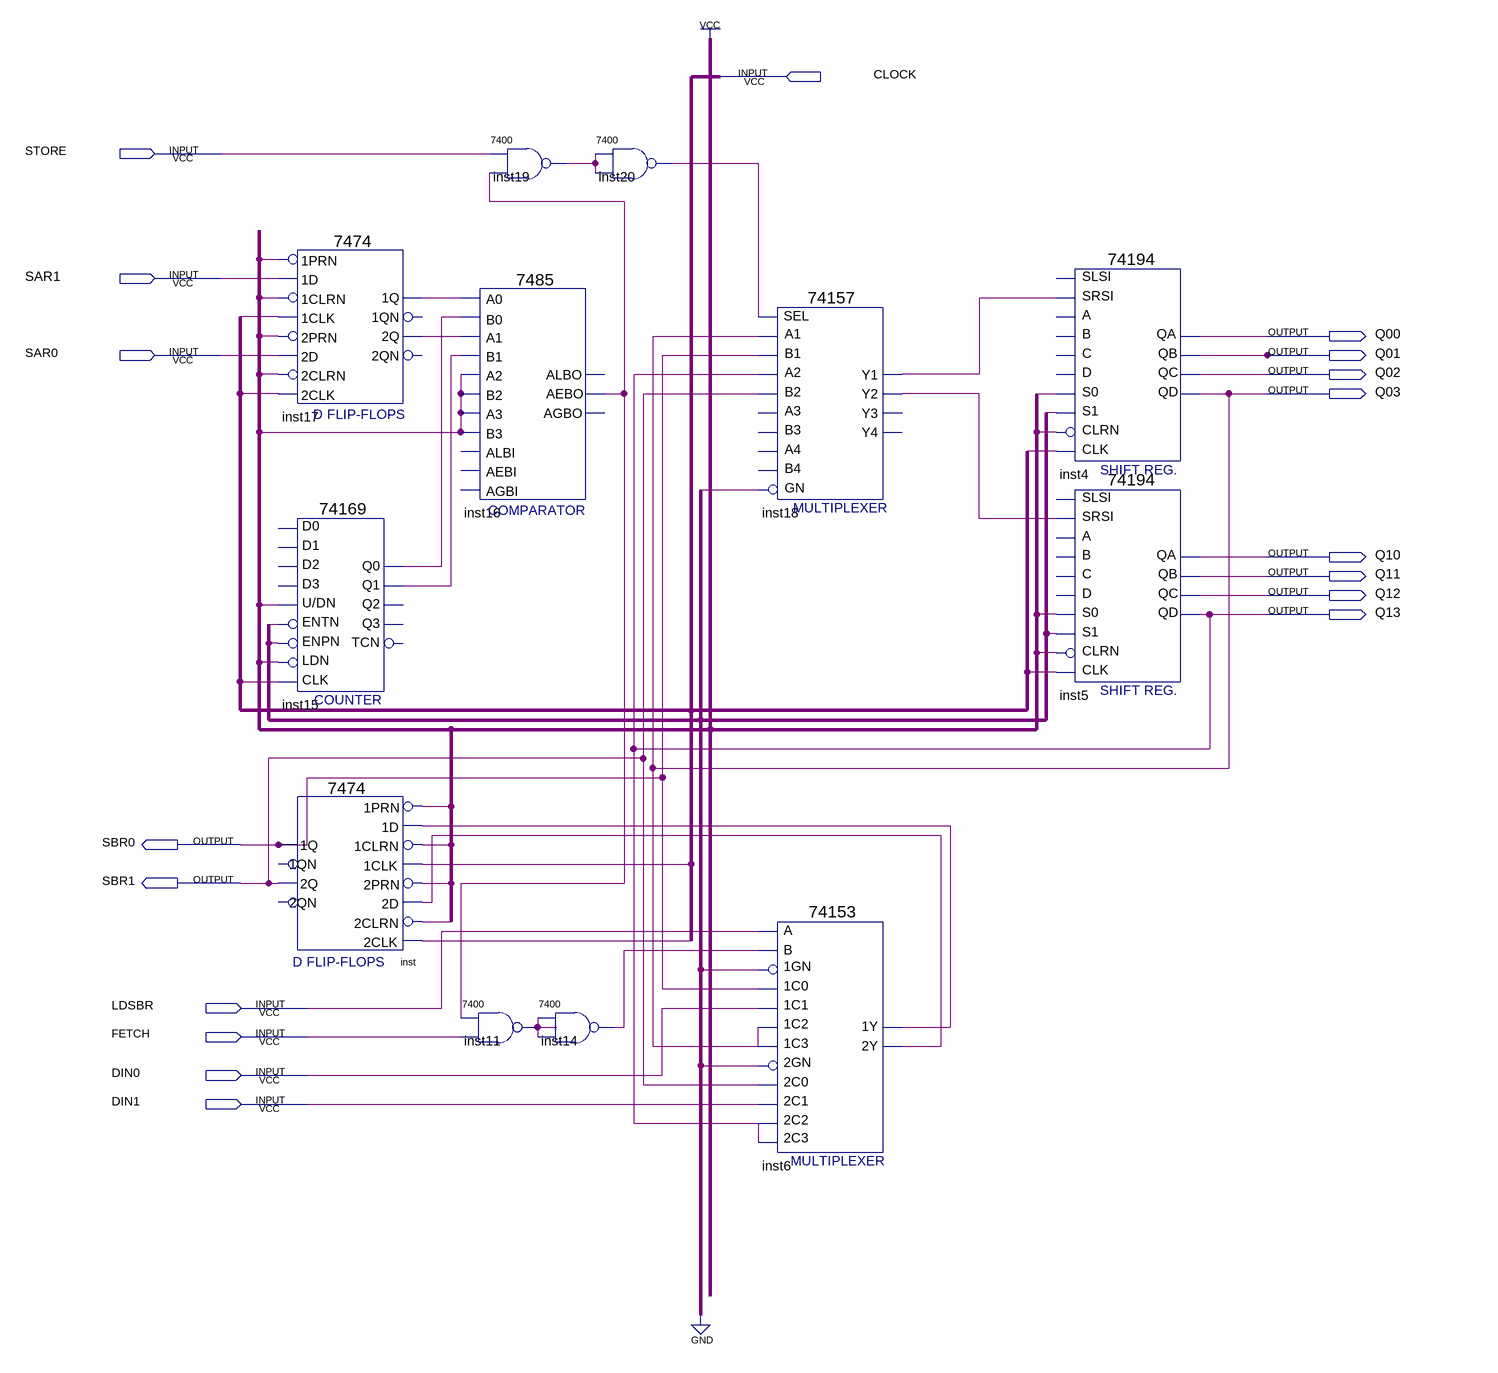
[diagram p0: schematic sheet]
// Quartus schematic LAB2.bdf as structural Verilog: 12 symbols, 18 pins
module LAB2 (
  input  CLOCK,
  input  STORE,
  input  SAR1,
  input  SAR0,
  input  LDSBR,
  input  FETCH,
  input  DIN0,
  input  DIN1,
  output Q00,
  output Q01,
  output Q02,
  output Q03,
  output Q10,
  output Q11,
  output Q12,
  output Q13,
  output SBR0,
  output SBR1
);

  wire inst6_1y, inst6_2y, inst11_1, inst14_1, inst15_q0, inst15_q1, inst16_aebo, inst17_1q, inst17_2q,
       inst18_y1, inst18_y2, inst19_1, inst20_1;

  \7474  inst17 (
    .\2D (SAR0), .\2PRN (1'b1), .\1CLK (CLOCK), .\1D (SAR1), .\1PRN (1'b1), .\2CLK (CLOCK), .\2CLRN (1'b1),
    .\1CLRN (1'b1), .\2Q (inst17_2q), .\1Q (inst17_1q));  // open: 1QN, 2QN
  \74169  inst15 (
    .ENTN(1'b0), .\U/DN (1'b1), .LDN(1'b1), .CLK(CLOCK), .ENPN(1'b0), .Q1(inst15_q1), .Q0(inst15_q0));  // open: D1, D2, D0, D3, Q2, TCN, Q3
  \7474  inst (
    .\2D (inst6_2y), .\2PRN (1'b1), .\1CLK (CLOCK), .\1D (inst6_1y), .\1PRN (1'b1), .\2CLK (CLOCK),
    .\2CLRN (1'b1), .\1CLRN (1'b1), .\2Q (SBR1), .\1Q (SBR0));  // open: 1QN, 2QN
  \7400  inst19 (.\3 (inst16_aebo), .\2 (STORE), .\1 (inst19_1));
  \7485  inst16 (
    .A3(1'b1), .B2(1'b1), .A2(1'b1), .A0(inst17_1q), .B0(inst15_q0), .B3(1'b1), .A1(inst17_2q),
    .B1(inst15_q1), .AEBO(inst16_aebo));  // open: AEBI, AGBI, ALBI, ALBO, AGBO
  \7400  inst11 (.\3 (FETCH), .\2 (inst16_aebo), .\1 (inst11_1));
  \7400  inst20 (.\3 (inst19_1), .\2 (inst19_1), .\1 (inst20_1));
  \7400  inst14 (.\3 (inst11_1), .\2 (inst11_1), .\1 (inst14_1));
  \74157  inst18 (
    .A1(Q03), .B1(SBR0), .SEL(inst20_1), .B2(SBR1), .A2(Q13), .GN(1'b0), .Y2(inst18_y2), .Y1(inst18_y1));  // open: A3, B3, B4, A4, Y4, Y3
  \74153  inst6 (
    .\1C1 (DIN0), .\1GN (1'b0), .\1C0 (SBR0), .\2C0 (SBR1), .\2GN (1'b0), .\2C2 (Q13), .\1C2 (Q03),
    .\1C3 (Q03), .B(inst14_1), .A(LDSBR), .\2C1 (DIN1), .\2C3 (Q13), .\1Y (inst6_1y), .\2Y (inst6_2y));
  \74194  inst4 (
    .SRSI(inst18_y1), .CLK(CLOCK), .CLRN(1'b1), .S1(1'b0), .S0(1'b1), .QA(Q00), .QB(Q01), .QC(Q02), .QD(Q03));  // open: SLSI, B, C, D, A
  \74194  inst5 (
    .SRSI(inst18_y2), .CLK(CLOCK), .CLRN(1'b1), .S1(1'b0), .S0(1'b1), .QA(Q10), .QB(Q11), .QC(Q12), .QD(Q13));  // open: SLSI, B, C, D, A
endmodule
